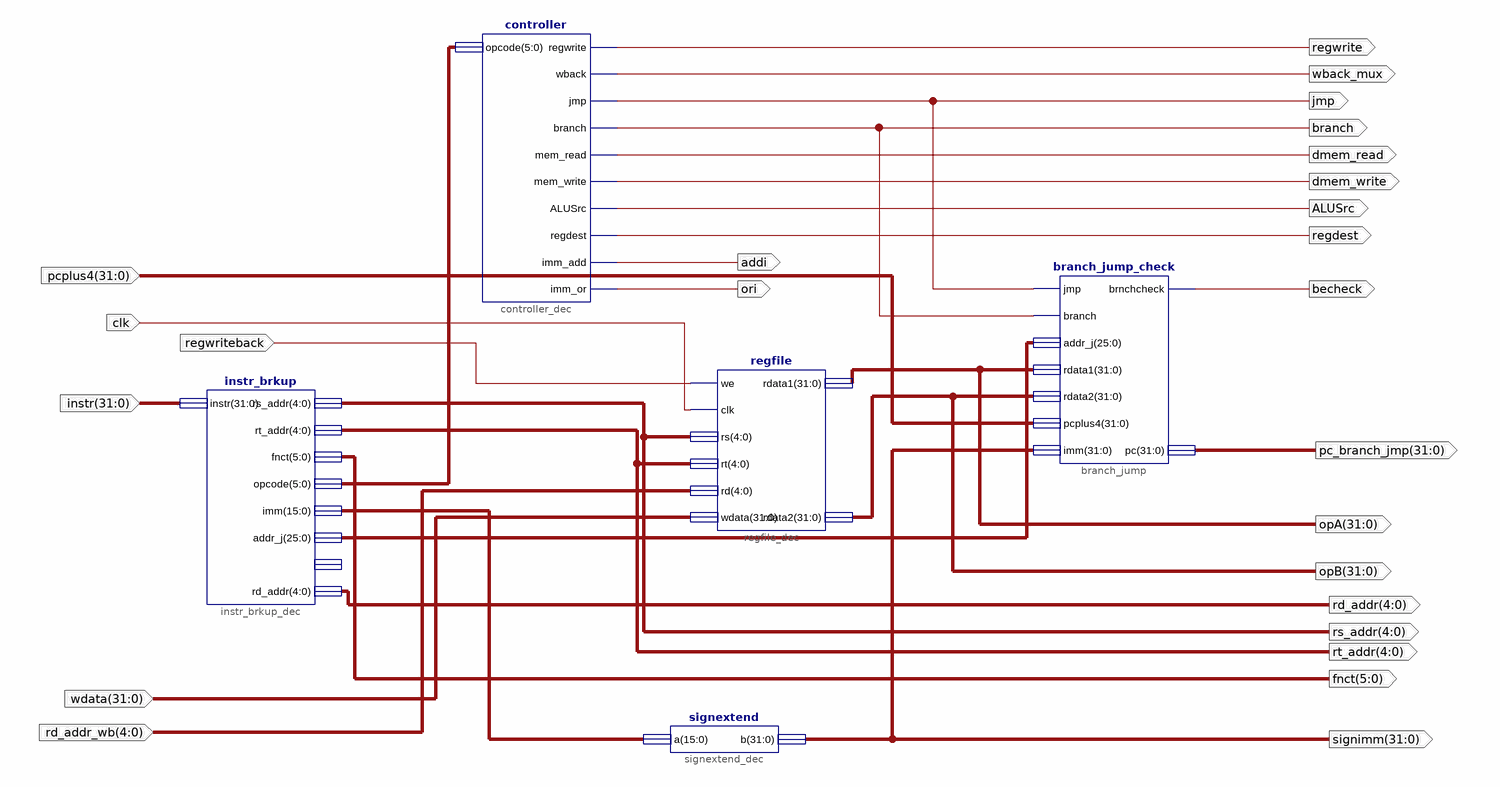
[diagram p0: schematic sheet 1]
// Xilinx ISE schematic dec_regread.sch (spartan3a) as structural Verilog: 5 symbols, 25 ports
module dec_regread (
  input  [31:0] instr,
  input  [31:0] wdata,
  input  [31:0] pcplus4,
  input  [4:0] rd_addr_wb,
  input  regwriteback,
  input  clk,
  output [4:0] rs_addr,
  output [4:0] rt_addr,
  output [31:0] signimm,
  output becheck,
  output [31:0] pc_branch_jmp,
  output wback_mux,
  output jmp,
  output dmem_read,
  output dmem_write,
  output ALUSrc,
  output regdest,
  output [5:0] fnct,
  output [31:0] opB,
  output branch,
  output [31:0] opA,
  output [4:0] rd_addr,
  output regwrite,
  output addi,
  output ori
);

  wire [5:0] XLXN_4;
  wire [15:0] XLXN_45;
  wire [25:0] XLXN_34;

  signextend signextend_dec (.a(XLXN_45), .b(signimm));
  instr_brkup instr_brkup_dec (
    .instr(instr), .rd_addr(rd_addr), .rs_addr(rs_addr), .rt_addr(rt_addr), .fnct(fnct), .opcode(XLXN_4),
    .imm(XLXN_45), .addr_j(XLXN_34));  // open: shamnt
  controller controller_dec (
    .opcode(XLXN_4), .imm_add(addi), .imm_or(ori), .regwrite(regwrite), .wback(wback_mux), .jmp(jmp),
    .branch(branch), .mem_read(dmem_read), .mem_write(dmem_write), .ALUSrc(ALUSrc), .regdest(regdest));
  regfile regfile_dec (
    .we(regwriteback), .clk(clk), .rs(rs_addr), .rt(rt_addr), .rd(rd_addr_wb), .wdata(wdata), .rdata1(opA),
    .rdata2(opB));
  branch_jump_check branch_jump (
    .jmp(jmp), .branch(branch), .addr_j(XLXN_34), .rdata1(opA), .rdata2(opB), .pcplus4(pcplus4),
    .imm(signimm), .brnchcheck(becheck), .pc(pc_branch_jmp));
endmodule
